# Altium schematic sheet MicroMod_ATP_CarrierBoard.SchDoc: MicroMod_ATP_CarrierBoard
size 456 x 318 mm; Origin: Eagle; Date: 4/11/2021 5:04:26 PM; SheetNumber: 1; DESIGNER: DESIGNER; REV: REV; GateName_1: G$1; SymbolName_1: FRAME_LEDGER; LibraryName: SparkFun-Aesthetics; DeviceSetName: FRAME-LEDGER; GateName_2: G$2; SymbolName_2: DOCFIELD; Sheet: Sheet:; ReleasedundertheCreativeCommons: Released under the Creative Commons; AttributionShare-Alike4.0License: Attribution Share-Alike 4.0 License; https://creativecommons.org/licenses/by-sa/4.0/: https://creativecommons.org/licenses/by-sa/4.0/; Designby: Design by:
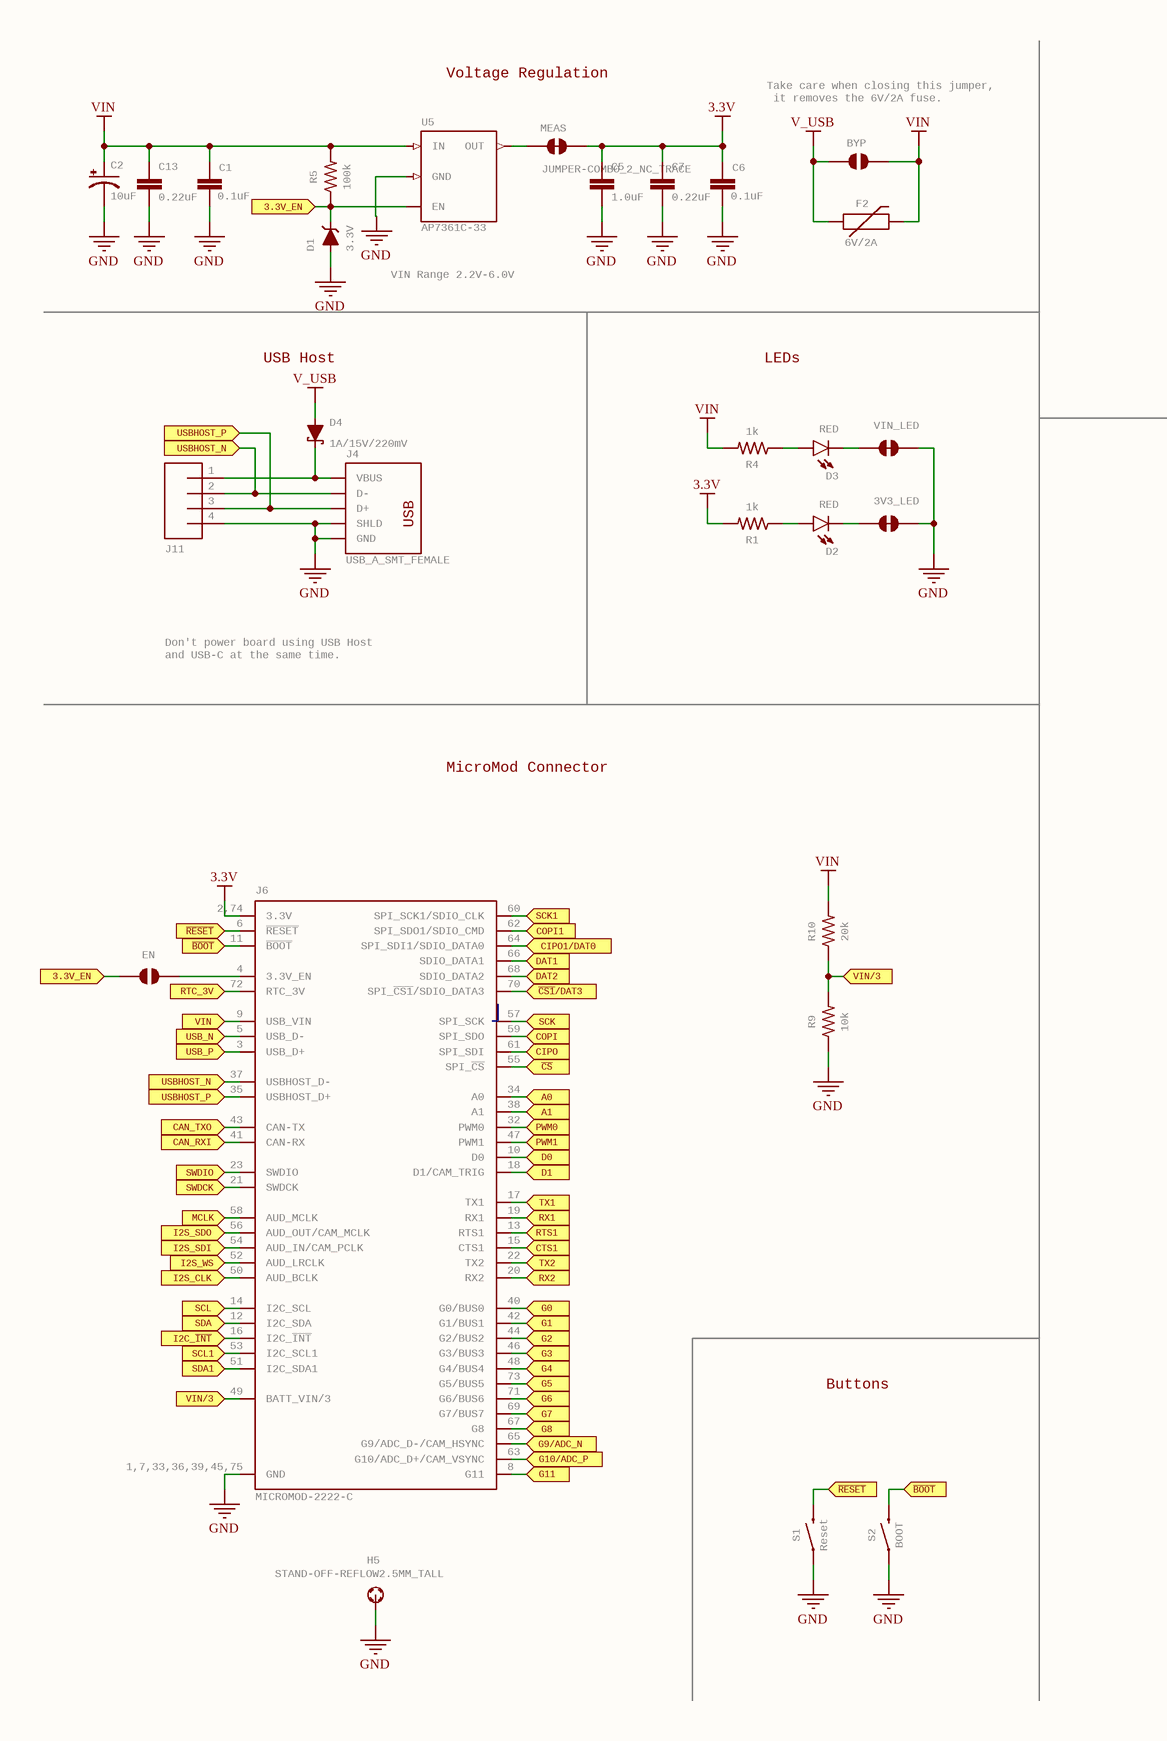
[diagram p0: MicroMod_ATP_CarrierBoard.SchDoc, left]
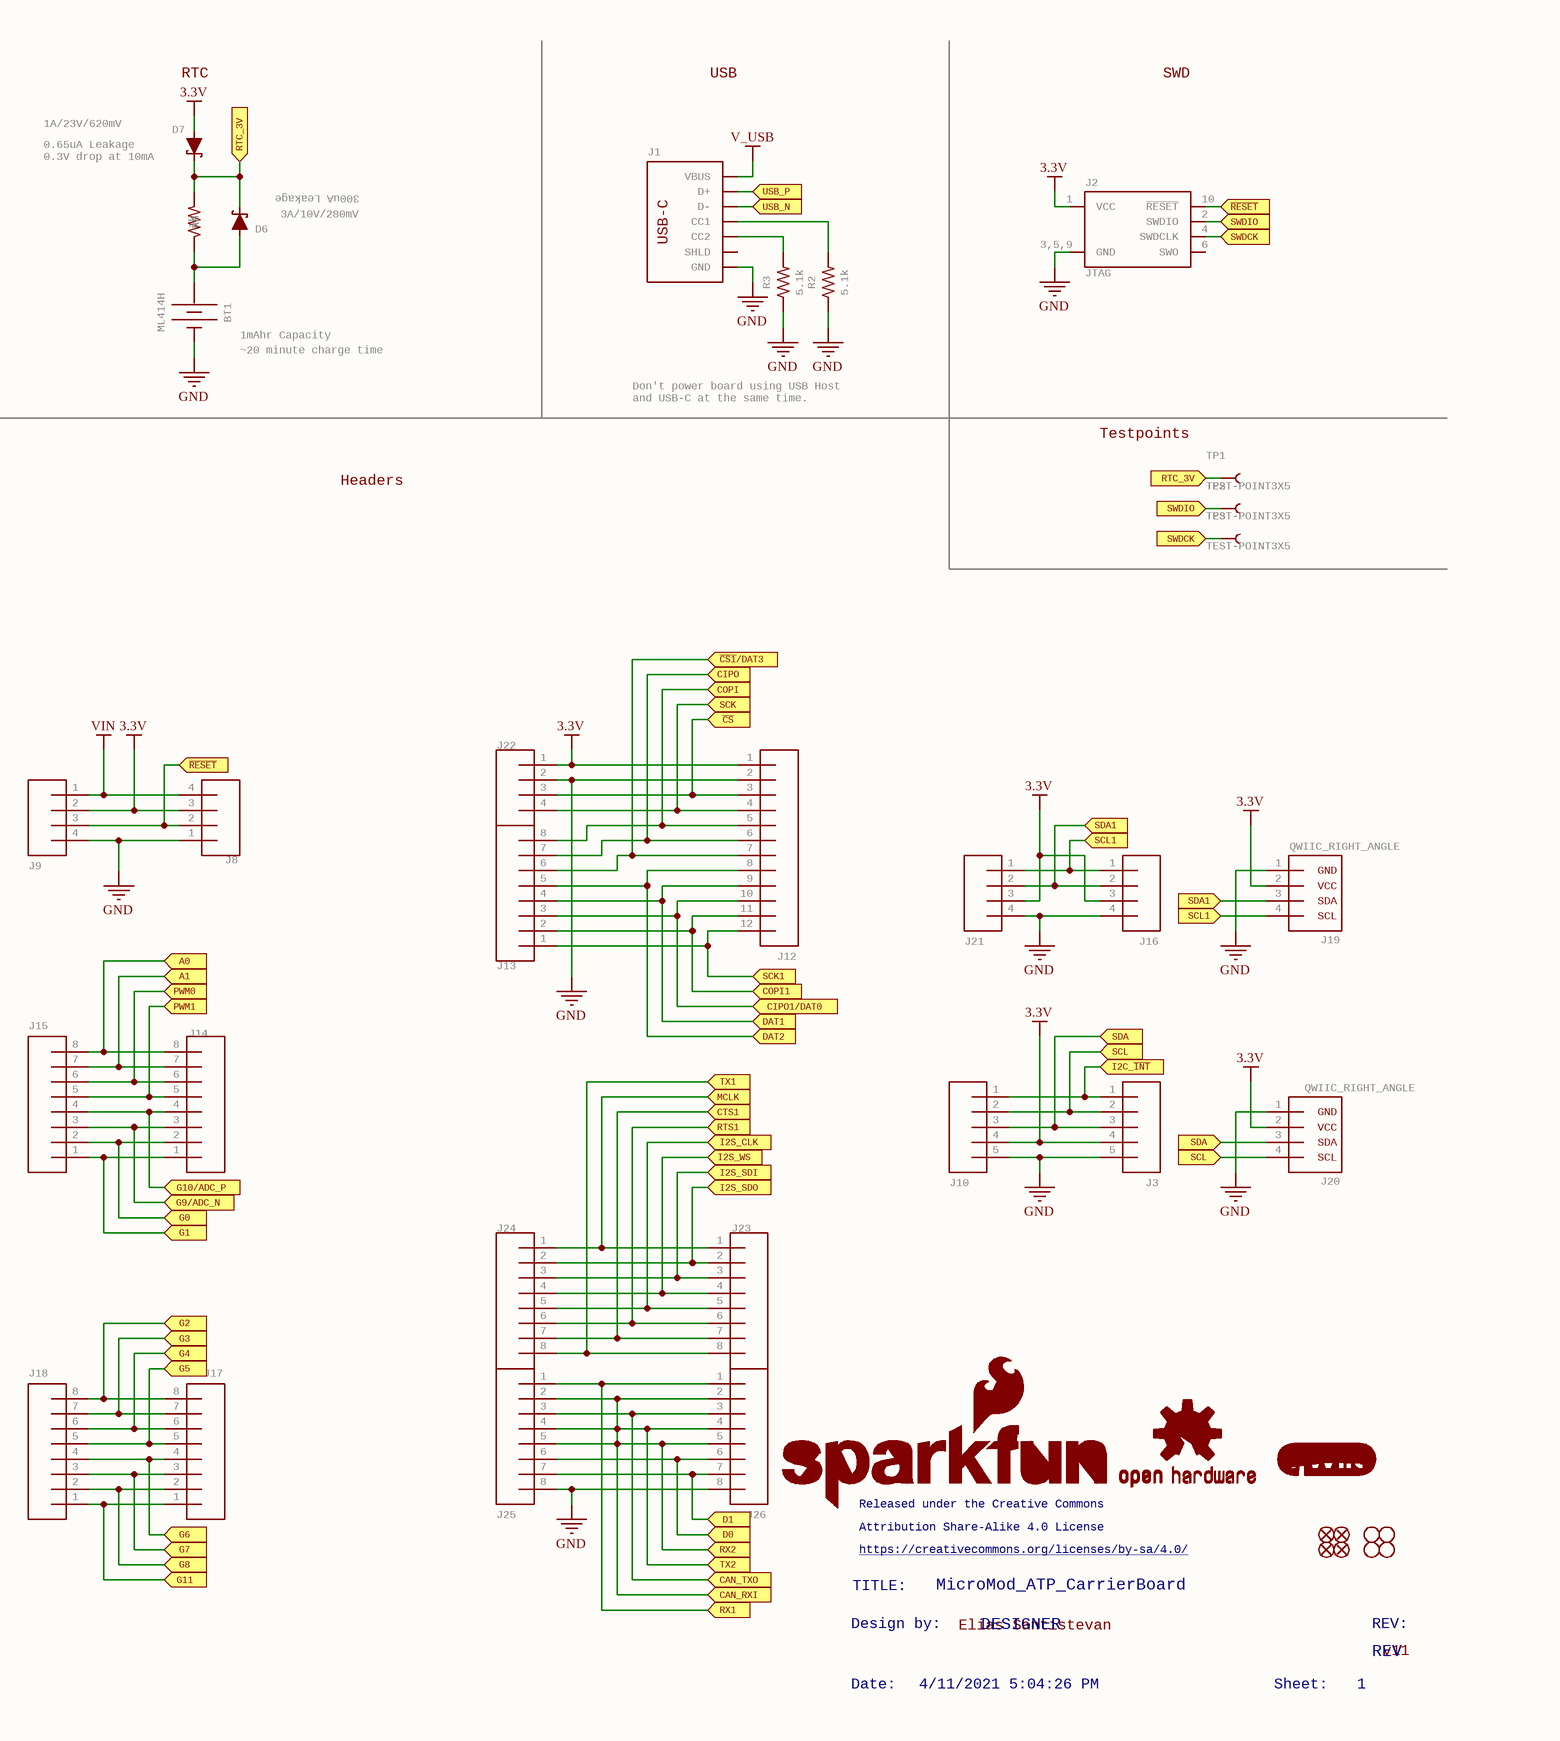
[diagram p1: MicroMod_ATP_CarrierBoard.SchDoc, right]

## Parts
3V3_LED  JUMPER-SMT_2_NC_TRACE_SILK  [SMT-JUMPER_2_NC_TRACE_SILK]  (value not drawn)
BT1  ML414H  [ML414H_IV01E]
BYP  JUMPER-SMT_2_NO_SILK  [SMT-JUMPER_2_NO_SILK]  (value not drawn)
C1  0.1uF  [0603]
C2  10uF  [EIA3216]
C5  1.0uF  [0603]
C6  0.1uF  [0603]
C7  0.22uF  [0603]
C13  0.22uF  [0603]
D1  3.3V  [SOD-323]
D2  RED  [LED-0603]
D3  RED  [LED-0603]
D4  1A/15V/220mV  [DO-214BA]
D6  3A/10V/280mV  [SOD-323]
D7  1A/23V/620mV  [SOD-323]
EN  JUMPER-SMT_2_NO_SILK  [SMT-JUMPER_2_NO_SILK]  (value not drawn)
F2  6V/2A  [1210]
FD1  FIDUCIALUFIDUCIAL  [FIDUCIAL-MICRO]  (value not drawn)
FD2  FIDUCIALUFIDUCIAL  [FIDUCIAL-MICRO]  (value not drawn)
FD3  FIDUCIALUFIDUCIAL  [FIDUCIAL-MICRO]  (value not drawn)
FD4  FIDUCIALUFIDUCIAL  [FIDUCIAL-MICRO]  (value not drawn)
H1  STAND-OFF  [STAND-OFF]  (value not drawn)
H2  STAND-OFF  [STAND-OFF]  (value not drawn)
H3  STAND-OFF  [STAND-OFF]  (value not drawn)
H4  STAND-OFF  [STAND-OFF]  (value not drawn)
H5  STAND-OFF-REFLOW2.5MM_TALL  [STAND-OFF-REFLOW-M2.5]
J1  USB_C_2-LAYER_PADS  [USB-C-16P-2LAYER-PADS]  (value not drawn)
J2  JTAG  [2X5-PTH-1.27MM]
J3  CONN_05NO_SILK  [1X05_NO_SILK]  (value not drawn)
J4  USB_A_SMT_FEMALE  [USB-A-S-SILK-FEMALE]
J6  MICROMOD-2222-C  [M.2-CONNECTOR-E]
J8  1X04_SMD_STRAIGHT_COMBO  [1X04_SMD_VERTICAL_COMBO]  (value not drawn)
J9  CONN_041X04_NO_SILK  [1X04_NO_SILK]  (value not drawn)
J10  CONN_05VERT_FEMALE_HEADER  [1X05_SMD_VERTICAL_COMBO]  (value not drawn)
J11  CONN_041X04_NO_SILK_NO_POP  [1X04_NO_SILK]  (value not drawn)
J12  CONN_12SMD_COMBINED  [1X12_SMD_COMBINED]  (value not drawn)
J13  CONN_08NO_SILK_DNP  [1X08_NO_SILK]  (value not drawn)
J14  CONN_08SMD-COMBO-FEMALE  [1X08_SMD_COMBINED]  (value not drawn)
J15  CONN_08NO_SILK_FEMALE_PTH  [1X08_NO_SILK]  (value not drawn)
J16  CONN_041X04_NO_SILK_NO_POP  [1X04_NO_SILK]  (value not drawn)
J17  CONN_08SMD-COMBO-FEMALE  [1X08_SMD_COMBINED]  (value not drawn)
J18  CONN_08NO_SILK_FEMALE_PTH  [1X08_NO_SILK]  (value not drawn)
J19  QWIIC_RIGHT_ANGLE  [JST04_1MM_RA]
J20  QWIIC_RIGHT_ANGLE  [JST04_1MM_RA]
J21  1X04_SMD_STRAIGHT_COMBO  [1X04_SMD_VERTICAL_COMBO]  (value not drawn)
J22  CONN_041X04_NO_SILK_NO_POP  [1X04_NO_SILK]  (value not drawn)
J23  CONN_08NO_SILK_FEMALE_PTH  [1X08_NO_SILK]  (value not drawn)
J24  CONN_08SMD-COMBO-FEMALE  [1X08_SMD_COMBINED]  (value not drawn)
J25  CONN_08SMD-COMBO-FEMALE  [1X08_SMD_COMBINED]  (value not drawn)
J26  CONN_08NO_SILK_FEMALE_PTH  [1X08_NO_SILK]  (value not drawn)
LOGO1  SFE_LOGO_NAME_FLAME.1_INCH  [SFE_LOGO_NAME_FLAME_.1]  (value not drawn)
LOGO2  QWIIC_LOGO_5MM  [QWIIC_5MM]  (value not drawn)
LOGO3  OSHW-LOGOMINI  [OSHW-LOGO-MINI]  (value not drawn)
MEAS  JUMPER-COMBO_2_NC_TRACE  [COMBO-JUMPER_2_NC_TRACE]
R1  1k  [0603]
R2  5.1k  [0603]
R3  5.1k  [0603]
R4  1k  [0603]
R5  100k  [0603]
R8  1k  [0603]
R9  10k  [0603]
R10  20k  [0603]
S1  Reset  [TACTILE_SWITCH_SMD_5.2MM]
S2  BOOT  [TACTILE_SWITCH_SMD_5.2MM]
TP1  TEST-POINT3X5  [PAD.03X.05]
TP2  TEST-POINT3X5  [PAD.03X.05]
TP3  TEST-POINT3X5  [PAD.03X.05]
U5  AP7361C-33  [UDFN-8]
VIN_LED  JUMPER-SMT_2_NC_TRACE_SILK  [SMT-JUMPER_2_NC_TRACE_SILK]  (value not drawn)

## Ports
3.3V_EN (in), A0 (in), A1 (in), CAN_RXI (in), CAN_TXO (in), CIPO1/DAT0 (in), CIPO (in), COPI1 (in), COPI (in), CTS1 (in), D0 (in), D1 (in), DAT1 (in), DAT2 (in), G0 (in), G1 (in), G2 (in), G3 (in), G4 (in), G5 (in), G6 (in), G7 (in), G8 (in), G9/ADC_N (in), G10/ADC_P (in), G11 (in), I2C_~{INT} (in), I2S_CLK (in), I2S_SDI (in), I2S_SDO (in), I2S_WS (in), MCLK (in), PWM0 (in), PWM1 (in), RTC_3V (in), RTS1 (in), RX1 (in), RX2 (in), SCK1 (in), SCK (in), SCL1 (in), SCL (in), SDA1 (in), SDA (in), SWDCK (in), SWDIO (in), TX1 (in), TX2 (in), USB_N (in), USB_P (in), USBHOST_N (in), USBHOST_P (in), VIN (in), VIN/3 (in), ~{BOOT} (in), ~{CS1}/DAT3 (in), ~{CS} (in), ~{RESET} (in)

## Nets
3.3V: C5.1 C6.1 C7.1 D7.A J2.1(VCC) J3.4 J6.2,74(3.3V) J8.3 J9.2 J10.4 J12.1 J16.3 J19.2 J20.2 J21.3 J22.1 MEAS.2,4 R1.2
GND: 3V3_LED.2 BT1.- C1.2 C2.- C5.2 C6.2 C7.2 C13.2 D1.A H5.1 J1.GND,GND2(GND) J2.3,5,9(GND) J3.5 J4.GND J4.SHLD1,2(SHLD) J6.1,7,33,36,39,45,75(GND) J8.1 J9.4 J10.5 J11.4 J12.2 J16.4 J19.1 J20.1 J21.4 J22.2 J25.8 J26.8 R2.1 R3.1 R9.1 S1.1,2 S2.1,2 U5.4,EP(GND) VIN_LED.2
V_USB: BYP.1 D4.A F2.1 J1.VBUS1,2(VBUS)
VIN: BYP.2 C1.1 C2.+ C13.1 F2.2 J8.4 J9.1 R4.2 R5.2 R10.2 U5.8(IN)
3.3V_EN: D1.C EN.1 R5.1 U5.5(EN) ; port 3.3V_EN
A0: J6.34(A0) J14.8 J15.8 ; port A0
A1: J6.38(A1) J14.7 J15.7 ; port A1
~{BOOT}: J6.11(~{BOOT}) S2.3,4 ; port ~{BOOT}
~{CS}: J6.55(SPI_~{CS}) J12.3 J22.3 ; port ~{CS}
~{CS1}/DAT3: J6.70(SPI_~{CS1}/SDIO_DATA3) J12.7 J13.6 ; port ~{CS1}/DAT3
CAN_RXI: J6.20(RX2) J6.22(TX2) J6.41(CAN-RX) J25.2 J25.4 J25.5 J26.2 J26.4 J26.5 ; port CAN_RXI, port TX2, port RX2
CAN_TXO: J6.43(CAN-TX) J25.3 J26.3 ; port CAN_TXO
CIPO: J6.61(SPI_SDI) J12.6 J13.7 ; port CIPO
CIPO1/DAT0: J6.64(SPI_SDI1/SDIO_DATA0) J12.10 J13.3 ; port CIPO1/DAT0
COPI: J6.59(SPI_SDO) J12.5 J13.8 ; port COPI
COPI1: J6.62(SPI_SDO1/SDIO_CMD) J12.11 J13.2 ; port COPI1
CTS1: J6.15(CTS1) J23.7 J24.7 ; port CTS1
D0: J6.10(D0) J25.6 J26.6 ; port D0
D1: J6.18(D1/CAM_TRIG) J25.7 J26.7 ; port D1
DAT1: J6.66(SDIO_DATA1) J12.9 J13.4 ; port DAT1
DAT2: J6.68(SDIO_DATA2) J12.8 J13.5 ; port DAT2
G0: J6.40(G0/BUS0) J14.2 J15.2 ; port G0
G1: J6.42(G1/BUS1) J14.1 J15.1 ; port G1
G2: J6.44(G2/BUS2) J17.8 J18.8 ; port G2
G3: J6.46(G3/BUS3) J17.7 J18.7 ; port G3
G4: J6.48(G4/BUS4) J17.6 J18.6 ; port G4
G5: J6.73(G5/BUS5) J17.5 J18.5 ; port G5
G6: J6.71(G6/BUS6) J17.4 J18.4 ; port G6
G7: J6.69(G7/BUS7) J17.3 J18.3 ; port G7
G8: J6.67(G8) J17.2 J18.2 ; port G8
G9/ADC_N: J6.65(G9/ADC_D-/CAM_HSYNC) J14.3 J15.3 ; port G9/ADC_N
G10/ADC_P: J6.63(G10/ADC_D+/CAM_VSYNC) J14.4 J15.4 ; port G10/ADC_P
G11: J6.8(G11) J17.1 J18.1 ; port G11
I2C_~{INT}: J3.1 J6.16(I2C_~{INT}) J10.1 ; port I2C_~{INT}
I2S_CLK: J6.50(AUD_BCLK) J23.5 J24.5 ; port I2S_CLK
I2S_SDI: J6.54(AUD_IN/CAM_PCLK) J23.3 J24.3 ; port I2S_SDI
I2S_SDO: J6.56(AUD_OUT/CAM_MCLK) J23.2 J24.2 ; port I2S_SDO
I2S_WS: J6.52(AUD_LRCLK) J23.4 J24.4 ; port I2S_WS
MCLK: J6.58(AUD_MCLK) J23.1 J24.1 ; port MCLK
PWM0: J6.32(PWM0) J14.6 J15.6 ; port PWM0
PWM1: J6.47(PWM1) J14.5 J15.5 ; port PWM1
~{RESET}: J2.10(~{RESET}) J6.6(~{RESET}) J8.2 J9.3 S1.3,4 ; port ~{RESET}
RTC_3V: D6.C D7.C J6.72(RTC_3V) R8.2 TP1.P$1 ; port RTC_3V
RTS1: J6.13(RTS1) J23.6 J24.6 ; port RTS1
RX1: J6.19(RX1) J25.1 J26.1 ; port RX1
SCK: J6.57(SPI_SCK) J12.4 J22.4 ; port SCK
SCK1: J6.60(SPI_SCK1/SDIO_CLK) J12.12 J13.1 ; port SCK1
SCL: J3.2 J6.14(I2C_SCL) J10.2 J20.4 ; port SCL
SCL1: J6.53(I2C_SCL1) J16.1 J19.4 J21.1 ; port SCL1
SDA: J3.3 J6.12(I2C_SDA) J10.3 J20.3 ; port SDA
SDA1: J6.51(I2C_SDA1) J16.2 J19.3 J21.2 ; port SDA1
SWDCK: J2.4(SWDCLK) J6.21(SWDCK) TP3.P$1 ; port SWDCK
SWDIO: J2.2(SWDIO) J6.23(SWDIO) TP2.P$1 ; port SWDIO
TX1: J6.17(TX1) J23.8 J24.8 ; port TX1
USB_N: J1.A7,B7(D-) J6.5(USB_D-) ; port USB_N
USB_P: J1.A6,B6(D+) J6.3(USB_D+) ; port USB_P
USBHOST_N: J4.D- J6.37(USBHOST_D-) J11.2 ; port USBHOST_N
USBHOST_P: J4.D+ J6.35(USBHOST_D+) J11.3 ; port USBHOST_P
VIN: J6.9(USB_VIN) ; port VIN  [a separate net that carries the same name]
VIN/3: J6.49(BATT_VIN/3) R9.2 R10.1 ; port VIN/3
Net3V3_LED_1: 3V3_LED.1 D2.C
NetBT1_+: BT1.+ D6.A R8.1
NetD2_A: D2.A R1.1
NetD3_A: D3.A R4.1
NetD3_C: D3.C VIN_LED.1
NetD4_C: D4.C J4.VBUS J11.1
NetEN_2: EN.2 J6.4(3.3V_EN)
NetJ1_A5: J1.A5(CC1) R2.2
NetJ1_B5: J1.B5(CC2) R3.2
NetMEAS_1,3: MEAS.1,3 U5.1(OUT)

Not connected (* = marked no-connect by the designer): J1 SHLD1-4(SHLD); J2 6(SWO)

## Notes on the sheet
- Voltage Regulation
- (near D7) RTC
- USB
- SWD
- Take care when closing this jumper,
  it removes the 6V/2A fuse.
- (near D7) 0.65uA Leakage
  0.3V drop at 10mA
- (near D6) 300uA Leakage
- VIN Range 2.2V-6.0V
- (near D4) USB Host
- LEDs
- (near BT1) ~20 minute charge time
- (near BT1) 1mAhr Capacity
- Don't power board using USB Host
  and USB-C at the same time.
- Testpoints
- Headers
- MicroMod Connector
- Buttons
- Released under the Creative Commons
- TITLE:
- Attribution Share-Alike 4.0 License
- https://creativecommons.org/licenses/by-sa/4.0/
- MicroMod_ATP_CarrierBoard
- Design by:
- Elias Santistevan
- DESIGNER
- REV:
- REV
- v11
- Date:
- 4/11/2021 5:04:26 PM
- Sheet:
- 1

## Library data of the parts
3V3_LED VIN_LED = JUMPER-SMT_2_NC_TRACE_SILK: Normally closed trace jumper    This jumper has a trace between two pads so it's normally closed (NC). Use a razor knife to open the connection. For best results follow the IPC guidelines for cutting traces: Cutout at least 0.063 mm (0.005 in).  Remove all loose material to clean up the cut area.  Seal the cut with an approved epoxy.       Reapply solder to reclose the connection.; GateName_1: G$1; SymbolName_1: SMT-JUMPER_2_NC_TRACE; DeviceName: _SILK; LibraryName: SparkFun-Jumpers; DeviceSetName: JUMPER-SMT_2_NC_TRACE
BT1 = ML414H_IV01E_BATTERY: SEIKO ML414H-IV01E Reflowable Lithium Battery    ML414H is a rechargeable, coin type battery with features such as Pb-free reflowable (Peak temperature: 260 C) and high temperature heat resistance. Battery Characteristics:  3.1V max voltage  Voff is 2V  1mAH  3k series resistor with battery  72 hour charge time from 2.0-3.1V  2.3-2.8V initial charge; GateName_1: G$1; PROD_ID: BATT-14267; SymbolName_1: BATTERY; LibraryName: SparkFun-Batteries; DeviceSetName: ML414H_IV01E_BATTERY
BYP EN = JUMPER-SMT_2_NO_SILK: Normally open jumper    This jumper has two pads in close proximity to each other. Apply solder to close the connection.   Round pads are easier to solder for beginners, but are a lot larger.   SparkFun Product that uses the round pads:  SparkFun EL Sequencer; GateName_1: G$1; SymbolName_1: SMT-JUMPER_2_NO; DeviceName: _SILK; LibraryName: SparkFun-Jumpers; DeviceSetName: JUMPER-SMT_2_NO
C1 C6 = 0.1UF-0603-25V-(+80/-20%): 0.1ÂµF ceramic capacitors    A capacitor is a passive two-terminal electrical component used to store electrical energy temporarily in an electric field.; GateName_1: G$1; SymbolName_1: CAP; PROD_ID: CAP-00810; DeviceName: -0603-25V-(+80/-20%); LibraryName: SparkFun-Capacitors; DeviceSetName: 0.1UF
C2 = 10UF-POLAR-EIA3216-16V-10%(TANT): 10.0ÂµF polarized capacitors    A capacitor is a passive two-terminal electrical component used to store electrical energy temporarily in an electric field.; GateName_1: G$1; SymbolName_1: CAP_POL; PROD_ID: CAP-00811; DeviceName: -EIA3216-16V-10%(TANT); LibraryName: SparkFun-Capacitors; DeviceSetName: 10UF-POLAR
C5 = 1.0UF-0603-16V-10%: 1ÂµF ceramic capacitors    A capacitor is a passive two-terminal electrical component used to store electrical energy temporarily in an electric field.; GateName_1: G$1; SymbolName_1: CAP; PROD_ID: CAP-00868; DeviceName: -0603-16V-10%; LibraryName: SparkFun-Capacitors; DeviceSetName: 1.0UF
C7 C13 = 0.22UF-0603-25V-10%: 0.22ÂµF ceramic capacitors    A capacitor is a passive two-terminal electrical component used to store electrical energy temporarily in an electric field.; GateName_1: G$1; SymbolName_1: CAP; PROD_ID: CAP-07822; DeviceName: -0603-25V-10%; LibraryName: SparkFun-Capacitors; DeviceSetName: 0.22UF
D1 = DIODE-ZENER-MM3Z3V3T1G: Zener Diode    A Zener diode allows current to flow from its anode to its cathode like a normal semiconductor diode, but it also permits current to flow in the reverse direction when its "Zener voltage" is reached. - WIkipedia; GateName_1: G$1; PROD_ID: DIO-11284; SymbolName_1: DIODE-ZENER; DeviceName: -MM3Z3V3T1G; LibraryName: SparkFun-DiscreteSemi; DeviceSetName: DIODE-ZENER
D2 D3 = LED-RED0603: Red SMD LED    Used in manufacturing of most products at SparkFun   Packages: 0603 - SMD 0603 package [Product Link]  0603 SMART - SMD 0603 SMART package ( more efficient and expensive)[Product Link]   1206 - SMD1206  package [Product Link]    SparkFun Products: Pro Mini 328 -5V  RedBoard  IOIO-OTG; GateName_1: G$1; DeviceName: 0603; PROD_ID: DIO-00819; SymbolName_1: LED; LibraryName: SparkFun-LED; DeviceSetName: LED-RED
D4 = DIODE-SCHOTTKY-LSM115JE3: Schottky diode    A Schottky diode is a semiconductor diode which has a low forward voltage drop and a very fast switching action.; GateName_1: G$1; PROD_ID: DIO-15271; SymbolName_1: DIODE-SCHOTTKY; DeviceName: -LSM115JE3; LibraryName: SparkFun-DiscreteSemi; DeviceSetName: DIODE-SCHOTTKY
D6 = DIODE-SCHOTTKY-BAT60A: Schottky diode    A Schottky diode is a semiconductor diode which has a low forward voltage drop and a very fast switching action.; GateName_1: G$1; PROD_ID: DIO-14072; SymbolName_1: DIODE-SCHOTTKY; DeviceName: -BAT60A; LibraryName: SparkFun-DiscreteSemi; DeviceSetName: DIODE-SCHOTTKY
D7 = DIODE-SCHOTTKY-BAT20J: Schottky diode    A Schottky diode is a semiconductor diode which has a low forward voltage drop and a very fast switching action.; GateName_1: G$1; PROD_ID: DIO-11623; SymbolName_1: DIODE-SCHOTTKY; DeviceName: -BAT20J; LibraryName: SparkFun-DiscreteSemi; DeviceSetName: DIODE-SCHOTTKY
F2 = PPTC_6V2A: Resettable Fuse PPTC    Resettable Fuse. Really a sort of resistor with a polymeric positive temperature coefficient whose resistance increases dramatically with an increase in temperature. When heated by the power passing through the resistance rises causing the current to be limited, protecting the circuit. This is achieved by the transition of the polymer from a crystalline to an amorphous state where the conductive carbon separates breaking the conductive pathways found in the cool crystalline structure. When a PPTC cools back down it resumes conducting letting the circuit turn back on.   SparkFun Products:  SparkFun RedBoard - Programmed with Arduino  Pro Micro - 5V/16MHz  Arduino Pro 328 - 5V/16MHz  MP3 Trigger; GateName_1: F1; DeviceName: _6V2A; PROD_ID: RES-14313; SymbolName_1: PPTC; LibraryName: SparkFun-Fuses; DeviceSetName: PPTC
FD1-FD4 = FIDUCIALUFIDUCIAL: Fiducial Alignment Points    Point-of-reference for pick-and-place machines and other optical instruments.; GateName_1: G$1; SymbolName_1: FIDUCIAL; DeviceName: UFIDUCIAL; LibraryName: SparkFun-Aesthetics; DeviceSetName: FIDUCIAL
H1-H4 = STAND-OFF: Stand Off    Drill holes for mechanically mounting via screws, standoffs, etc.   Note: Use the keepout ring to avoid running the screw head into surrounding components.  Variant Overviews  STAND-OFF - Mechanical footprint for a #4 phillips button head screw.  STAND-OFF-TIGHT - Mechanical footprint for a #4 phillips button head screw,      Example SparkFun Products  Screw - Phillips Head (1/4", 4-40, 10 pack) (PRT-10453)  Screw - Phillips Head (1/2", 4-40, 10 pack) (PRT-10452)  Screw - Phillips Head (3/4", 4-40, 10 pack) (PRT-10451)  Screw - Phillips Head (1", 4-40, 10 pack) (PRT-10450); GateName_1: G$1; SymbolName_1: STAND-OFF; LibraryName: SparkFun-Hardware; DeviceSetName: STAND-OFF
H5 = STAND-OFF-REFLOW2.5MM_TALL: Stand Off Reflow Compatible    A metal standoff that can be placed and reflowed onto a PCB.; GateName_1: G$1; PROD_ID: HW-14899; SymbolName_1: STAND-OFF-REFLOW; DeviceName: 2.5MM_TALL; LibraryName: SparkFun-Hardware; DeviceSetName: STAND-OFF-REFLOW
J1 = USB_C_2-LAYER_PADS: USB Type C 16Pin Connector Super Speed pins not available on the 16-pin purely SMD connector so this part is best for USB 2.0 implementations. D1 and D2 are tied together enabling D+/- no matter which way the cable is plugged into the connector. The two channel configuration pins (CC1/2) are exposed. These are normally connected to ground via 5.1k resistors but can be reconfigured for high current/high power applications.; GateName_1: J1; SymbolName_1: USB-C-MINIMUM; DeviceSetName: USB_C; PROD_ID: CONN-14122; DeviceName: _2-LAYER_PADS; LibraryName: SparkFun-Connectors; USB-C: USB-C
J2 = CORTEX_JTAG_DEBUG_MINIMUM_PTH: Cortex Debug Connector - 10 pin    Supports JTAG debug, Serial Wire debug, and Serial Wire Viewer. PTH and SMD connector options available.    General Connector Information    Products: PTH Connector -via Digi-Key  SparkFun PSoc  SparkFun T; GateName_1: G$1; SymbolName_1: CORTEX_DEBUG_MINIMUM; DeviceName: _PTH; LibraryName: SparkFun-Connectors; DeviceSetName: CORTEX_JTAG_DEBUG_MINIMUM
J3 = CONN_05NO_SILK: Multi connection point. Often used as Generic Header-pin footprint for 0.1 inch spaced/style header connections    On any of the 0.1 inch spaced packages, you can populate with these:  Break Away Headers - Straight (PRT-00116)   Break Away Male Headers - Right Angle (PRT-00553)   Female Headers (PRT-00115)   Break Away Headers - Machine Pin (PRT-00117)   Break Away Female Headers - Swiss Machine Pin (PRT-00743)        For SCREWTERMINALS and SPRING TERMINALS visit here:  Screw Terimnals on SparkFun.com (5mm/3.5mm/2.54mm spacing)       This device is also useful as a general connection point to wire up your design to another part of your project. Our various solder wires solder well into these plated through hole pads.  Hook-Up Wire - Assortment (Stranded, 22 AWG) (PRT-11375)   Hook-Up Wire - Assortment (Solid Core, 22 AWG) (PRT-11367)   View the entire wire category on our website here          Special notes:     Molex polarized connector foot print use with SKU : PRT-08231 with associated crimp pins and housings. 1MM SMD Version SKU: PRT-10208; GateName_1: G$1; SymbolName_1: CONN_05; DeviceName: NO_SILK; LibraryName: SparkFun-Connectors; DeviceSetName: CONN_05
J4 = USB_A_SMT_FEMALE: USB-A Connector    Male and female variants, as well as PTH and SMT variants   SparkFun Products:  SparkFun XBee Explorer Dongle PTH Male  SparkFun MicroView-USB Programmer SMT Male  SparkFun USB Type A Female Breakout SMT Female; GateName_1: G$1; DeviceSetName: USB_A; PROD_ID: CONN-09520; SF_ID: PRT-09011; SymbolName_1: USB; DeviceName: _SMT_FEMALE; LibraryName: SparkFun-Connectors; USB: USB
J6 = MICROMOD-2222-C: MicroMod Connector  Description: A card edge connector and mating PCB connector to allow various MicroMod Processor Boards to be coupled with various carrier boards of different capabilities. Based on the M.2 standard.; GateName_1: J1; PROD_ID: CONN-14877; SymbolName_1: MICROMOD; DeviceName: -2222-C; LibraryName: SparkFun-MicroMod; DeviceSetName: MICROMOD
J8 J21 = CONN_04SMD_STRAIGHT_COMBO: Multi connection point. Often used as Generic Header-pin footprint for 0.1 inch spaced/style header connections    On any of the 0.1 inch spaced packages, you can populate with these:  Break Away Headers - Straight (PRT-00116)   Break Away Male Headers - Right Angle (PRT-00553)   Female Headers (PRT-00115)   Break Away Headers - Machine Pin (PRT-00117)   Break Away Female Headers - Swiss Machine Pin (PRT-00743)        For SCREWTERMINALS and SPRING TERMINALS visit here:  Screw Terimnals on SparkFun.com (5mm/3.5mm/2.54mm spacing)       This device is also useful as a general connection point to wire up your design to another part of your project. Our various solder wires solder well into these plated through hole pads.  Hook-Up Wire - Assortment (Stranded, 22 AWG) (PRT-11375)   Hook-Up Wire - Assortment (Solid Core, 22 AWG) (PRT-11367)   View the entire wire category on our website here          Special notes:     Molex polarized connector foot print use with SKU : PRT-08231 with associated crimp pins and housings. 1MM SMD Version SKU: PRT-10208; GateName_1: J1; PROD_ID: CONN-08511; SymbolName_1: CONN_04; DeviceName: SMD_STRAIGHT_COMBO; LibraryName: SparkFun-Connectors; DeviceSetName: CONN_04
J9 = CONN_041X04_NO_SILK: Multi connection point. Often used as Generic Header-pin footprint for 0.1 inch spaced/style header connections    On any of the 0.1 inch spaced packages, you can populate with these:  Break Away Headers - Straight (PRT-00116)   Break Away Male Headers - Right Angle (PRT-00553)   Female Headers (PRT-00115)   Break Away Headers - Machine Pin (PRT-00117)   Break Away Female Headers - Swiss Machine Pin (PRT-00743)        For SCREWTERMINALS and SPRING TERMINALS visit here:  Screw Terimnals on SparkFun.com (5mm/3.5mm/2.54mm spacing)       This device is also useful as a general connection point to wire up your design to another part of your project. Our various solder wires solder well into these plated through hole pads.  Hook-Up Wire - Assortment (Stranded, 22 AWG) (PRT-11375)   Hook-Up Wire - Assortment (Solid Core, 22 AWG) (PRT-11367)   View the entire wire category on our website here          Special notes:     Molex polarized connector foot print use with SKU : PRT-08231 with associated crimp pins and housings. 1MM SMD Version SKU: PRT-10208; GateName_1: J1; PROD_ID: CONN-09696; SymbolName_1: CONN_04; DeviceName: 1X04_NO_SILK; LibraryName: SparkFun-Connectors; DeviceSetName: CONN_04
J10 = CONN_05VERT_FEMALE_HEADER: Multi connection point. Often used as Generic Header-pin footprint for 0.1 inch spaced/style header connections    On any of the 0.1 inch spaced packages, you can populate with these:  Break Away Headers - Straight (PRT-00116)   Break Away Male Headers - Right Angle (PRT-00553)   Female Headers (PRT-00115)   Break Away Headers - Machine Pin (PRT-00117)   Break Away Female Headers - Swiss Machine Pin (PRT-00743)        For SCREWTERMINALS and SPRING TERMINALS visit here:  Screw Terimnals on SparkFun.com (5mm/3.5mm/2.54mm spacing)       This device is also useful as a general connection point to wire up your design to another part of your project. Our various solder wires solder well into these plated through hole pads.  Hook-Up Wire - Assortment (Stranded, 22 AWG) (PRT-11375)   Hook-Up Wire - Assortment (Solid Core, 22 AWG) (PRT-11367)   View the entire wire category on our website here          Special notes:     Molex polarized connector foot print use with SKU : PRT-08231 with associated crimp pins and housings. 1MM SMD Version SKU: PRT-10208; GateName_1: G$1; PROD_ID: CONN-15262; SymbolName_1: CONN_05; DeviceName: VERT_FEMALE_HEADER; LibraryName: SparkFun-Connectors; DeviceSetName: CONN_05
J11 J16 J22 = CONN_041X04_NO_SILK_NO_POP: Multi connection point. Often used as Generic Header-pin footprint for 0.1 inch spaced/style header connections    On any of the 0.1 inch spaced packages, you can populate with these:  Break Away Headers - Straight (PRT-00116)   Break Away Male Headers - Right Angle (PRT-00553)   Female Headers (PRT-00115)   Break Away Headers - Machine Pin (PRT-00117)   Break Away Female Headers - Swiss Machine Pin (PRT-00743)        For SCREWTERMINALS and SPRING TERMINALS visit here:  Screw Terimnals on SparkFun.com (5mm/3.5mm/2.54mm spacing)       This device is also useful as a general connection point to wire up your design to another part of your project. Our various solder wires solder well into these plated through hole pads.  Hook-Up Wire - Assortment (Stranded, 22 AWG) (PRT-11375)   Hook-Up Wire - Assortment (Solid Core, 22 AWG) (PRT-11367)   View the entire wire category on our website here          Special notes:     Molex polarized connector foot print use with SKU : PRT-08231 with associated crimp pins and housings. 1MM SMD Version SKU: PRT-10208; GateName_1: J1; SymbolName_1: CONN_04; DeviceName: 1X04_NO_SILK_NO_POP; LibraryName: SparkFun-Connectors; DeviceSetName: CONN_04
J12 = CONN_12SMD_COMBINED: Multi connection point. Often used as Generic Header-pin footprint for 0.1 inch spaced/style header connections    On any of the 0.1 inch spaced packages, you can populate with these:  Break Away Headers - Straight (PRT-00116)   Break Away Male Headers - Right Angle (PRT-00553)   Female Headers (PRT-00115)   Break Away Headers - Machine Pin (PRT-00117)   Break Away Female Headers - Swiss Machine Pin (PRT-00743)        For SCREWTERMINALS and SPRING TERMINALS visit here:  Screw Terimnals on SparkFun.com (5mm/3.5mm/2.54mm spacing)       This device is also useful as a general connection point to wire up your design to another part of your project. Our various solder wires solder well into these plated through hole pads.  Hook-Up Wire - Assortment (Stranded, 22 AWG) (PRT-11375)   Hook-Up Wire - Assortment (Solid Core, 22 AWG) (PRT-11367)   View the entire wire category on our website here          Special notes:     Molex polarized connector foot print use with SKU : PRT-08231 with associated crimp pins and housings. 1MM SMD Version SKU: PRT-10208    NOTES ON THE VARIANTS LOCK and LOCK_LONGPADS... This footprint was designed to help hold the alignment of a through-hole component (i.e.  6-pin header) while soldering it into place. You may notice that each hole has been shifted either up or down by 0.005 of an inch from it's more standard position (which is a perfectly straight line).  This slight alteration caused the pins (the squares in the middle) to touch the edges of the holes.  Because they are alternating, it causes a "brace" to hold the component in place.  0.005 has proven to be the perfect amount of "off-center" position when using our standard breakaway headers. Although looks a little odd when you look at the bare footprint, once you have a header in there, the alteration is very hard to notice.  Also,if you push a header all the way into place, it is covered up entirely on the bottom side.; GateName_1: G$1; PROD_ID: CONN-15197; SymbolName_1: CONN_12; DeviceName: SMD_COMBINED; LibraryName: SparkFun-Connectors; DeviceSetName: CONN_12
J13 = CONN_08NO_SILK_DNP: Multi connection point. Often used as Generic Header-pin footprint for 0.1 inch spaced/style header connections    On any of the 0.1 inch spaced packages, you can populate with these:  Break Away Headers - Straight (PRT-00116)   Break Away Male Headers - Right Angle (PRT-00553)   Female Headers (PRT-00115)   Break Away Headers - Machine Pin (PRT-00117)   Break Away Female Headers - Swiss Machine Pin (PRT-00743)   Arduino Stackable Header - 8 Pin (PRT-09279)        For SCREWTERMINALS and SPRING TERMINALS visit here:  Screw Terimnals on SparkFun.com (5mm/3.5mm/2.54mm spacing)       This device is also useful as a general connection point to wire up your design to another part of your project. Our various solder wires solder well into these plated through hole pads.  Hook-Up Wire - Assortment (Stranded, 22 AWG) (PRT-11375)   Hook-Up Wire - Assortment (Solid Core, 22 AWG) (PRT-11367)   View the entire wire category on our website here          Special notes:     Molex polarized connector foot print use with SKU : PRT-08231 with associated crimp pins and housings. 1MM SMD Version SKU: PRT-10208    NOTES ON THE VARIANTS LOCK and LOCK_LONGPADS... This footprint was designed to help hold the alignment of a through-hole component (i.e.  6-pin header) while soldering it into place. You may notice that each hole has been shifted either up or down by 0.005 of an inch from it's more standard position (which is a perfectly straight line).  This slight alteration caused the pins (the squares in the middle) to touch the edges of the holes.  Because they are alternating, it causes a "brace" to hold the component in place.  0.005 has proven to be the perfect amount of "off-center" position when using our standard breakaway headers. Although looks a little odd when you look at the bare footprint, once you have a header in there, the alteration is very hard to notice.  Also,if you push a header all the way into place, it is covered up entirely on the bottom side.; GateName_1: G$1; SymbolName_1: CONN_08; DeviceName: NO_SILK_DNP; LibraryName: SparkFun-Connectors; DeviceSetName: CONN_08
J14 J17 J24 J25 = CONN_08SMD-COMBO-FEMALE: Multi connection point. Often used as Generic Header-pin footprint for 0.1 inch spaced/style header connections    On any of the 0.1 inch spaced packages, you can populate with these:  Break Away Headers - Straight (PRT-00116)   Break Away Male Headers - Right Angle (PRT-00553)   Female Headers (PRT-00115)   Break Away Headers - Machine Pin (PRT-00117)   Break Away Female Headers - Swiss Machine Pin (PRT-00743)   Arduino Stackable Header - 8 Pin (PRT-09279)        For SCREWTERMINALS and SPRING TERMINALS visit here:  Screw Terimnals on SparkFun.com (5mm/3.5mm/2.54mm spacing)       This device is also useful as a general connection point to wire up your design to another part of your project. Our various solder wires solder well into these plated through hole pads.  Hook-Up Wire - Assortment (Stranded, 22 AWG) (PRT-11375)   Hook-Up Wire - Assortment (Solid Core, 22 AWG) (PRT-11367)   View the entire wire category on our website here          Special notes:     Molex polarized connector foot print use with SKU : PRT-08231 with associated crimp pins and housings. 1MM SMD Version SKU: PRT-10208    NOTES ON THE VARIANTS LOCK and LOCK_LONGPADS... This footprint was designed to help hold the alignment of a through-hole component (i.e.  6-pin header) while soldering it into place. You may notice that each hole has been shifted either up or down by 0.005 of an inch from it's more standard position (which is a perfectly straight line).  This slight alteration caused the pins (the squares in the middle) to touch the edges of the holes.  Because they are alternating, it causes a "brace" to hold the component in place.  0.005 has proven to be the perfect amount of "off-center" position when using our standard breakaway headers. Although looks a little odd when you look at the bare footprint, once you have a header in there, the alteration is very hard to notice.  Also,if you push a header all the way into place, it is covered up entirely on the bottom side.; GateName_1: G$1; PROD_ID: CONN-10204; SF_ID: PRT-11543; SymbolName_1: CONN_08; DeviceName: SMD-COMBO-FEMALE; LibraryName: SparkFun-Connectors; DeviceSetName: CONN_08
J15 J18 J23 J26 = CONN_08NO_SILK_FEMALE_PTH: Multi connection point. Often used as Generic Header-pin footprint for 0.1 inch spaced/style header connections    On any of the 0.1 inch spaced packages, you can populate with these:  Break Away Headers - Straight (PRT-00116)   Break Away Male Headers - Right Angle (PRT-00553)   Female Headers (PRT-00115)   Break Away Headers - Machine Pin (PRT-00117)   Break Away Female Headers - Swiss Machine Pin (PRT-00743)   Arduino Stackable Header - 8 Pin (PRT-09279)        For SCREWTERMINALS and SPRING TERMINALS visit here:  Screw Terimnals on SparkFun.com (5mm/3.5mm/2.54mm spacing)       This device is also useful as a general connection point to wire up your design to another part of your project. Our various solder wires solder well into these plated through hole pads.  Hook-Up Wire - Assortment (Stranded, 22 AWG) (PRT-11375)   Hook-Up Wire - Assortment (Solid Core, 22 AWG) (PRT-11367)   View the entire wire category on our website here          Special notes:     Molex polarized connector foot print use with SKU : PRT-08231 with associated crimp pins and housings. 1MM SMD Version SKU: PRT-10208    NOTES ON THE VARIANTS LOCK and LOCK_LONGPADS... This footprint was designed to help hold the alignment of a through-hole component (i.e.  6-pin header) while soldering it into place. You may notice that each hole has been shifted either up or down by 0.005 of an inch from it's more standard position (which is a perfectly straight line).  This slight alteration caused the pins (the squares in the middle) to touch the edges of the holes.  Because they are alternating, it causes a "brace" to hold the component in place.  0.005 has proven to be the perfect amount of "off-center" position when using our standard breakaway headers. Although looks a little odd when you look at the bare footprint, once you have a header in there, the alteration is very hard to notice.  Also,if you push a header all the way into place, it is covered up entirely on the bottom side.; GateName_1: G$1; PROD_ID: CONN-08438; SymbolName_1: CONN_08; DeviceName: NO_SILK_FEMALE_PTH; LibraryName: SparkFun-Connectors; DeviceSetName: CONN_08
J19 J20 = QWIIC_CONNECTORJS-1MM: SparkFun I2C Standard Qwiic Connector An SMD 1mm pitch JST connector makes it easy and quick (get it? Qwiic?) to connect I2C devices to each other. The Qwiic system enables fast and solderless connection between popular platforms and various sensors and actuators.   We carry 200mm, 100mm, 50mm, and breadboard friendly Qwiic cables. We also offer 10 pcs strips the SMD connectors.; GateName_1: G$1; SymbolName_1: I2C_STANDARD; DeviceName: JS-1MM; PROD_ID: CONN-13694; LibraryName: SparkFun-Connectors; DeviceSetName: QWIIC_CONNECTOR; SDA: SDA; VCC: VCC; GND: GND; SCL: SCL
LOGO1 = SFE_LOGO_NAME_FLAME.1_INCH: SparkFun Font Logo w/ Flame    This is the SparkFun full logo. The logo on the schematic will always be the same size; the package variant is the height of the flame part of the logo. Default layer for the logo on the board is tSilk.; GateName_1: G$1; SymbolName_1: SFE_LOGO_NAME_FLAME; DeviceName: .1_INCH; LibraryName: SparkFun-Aesthetics; DeviceSetName: SFE_LOGO_NAME_FLAME
LOGO2 = QWIIC_LOGO_5MM: Qwiic Logos for placement on schematic and PCB. The 5.5mm silk logo is best for placing next to Qwiic connector.; GateName_1: G$1; DeviceName: _5MM; SymbolName_1: LOGO; LibraryName: SparkFun-Aesthetics; DeviceSetName: QWIIC_LOGO
LOGO3 = OSHW-LOGOMINI: Open-Source Hardware (OSHW) Logo     This logo indicates the piece of hardware it is found on incorporates a OSHW license and/or adheres to the definition of open source hardware found here: http://freedomdefined.org/OSHW; GateName_1: G$1; DeviceName: MINI; SymbolName_1: OSHW-LOGO; LibraryName: SparkFun-Aesthetics; DeviceSetName: OSHW-LOGO
MEAS = JUMPER-COMBO_2_NC_TRACE: GateName_1: JP1; SymbolName_1: SMT-JUMPER_2_NC_TRACE-1; LibraryName: SparkFun-Jumpers; DeviceSetName: JUMPER-COMBO_2_NC_TRACE
R1 R4 R8 = 1KOHM-0603-1/10W-1%: 1kÎ© resistor    A resistor is a passive two-terminal electrical component that implements electrical resistance as a circuit element. Resistors act to reduce current flow, and, at the same time, act to lower voltage levels within circuits. - Wikipedia; GateName_1: G$1; DeviceSetName: 1KOHM; PROD_ID: RES-07856; SymbolName_1: RESISTOR; DeviceName: -0603-1/10W-1%; LibraryName: SparkFun-Resistors
R2 R3 = 5.1KOHM5.1KOHM-0603-1/10W-1%: GateName_1: R1; SymbolName_1: RESISTOR; PROD_ID: RES-12083; DeviceName: 5.1KOHM-0603-1/10W-1%; LibraryName: SparkFun-Resistors; DeviceSetName: 5.1KOHM
R5 = 100KOHM-0603-1/10W-1%: 100kÎ© resistor    A resistor is a passive two-terminal electrical component that implements electrical resistance as a circuit element. Resistors act to reduce current flow, and, at the same time, act to lower voltage levels within circuits. - Wikipedia; GateName_1: G$1; PROD_ID: RES-07828; SymbolName_1: RESISTOR; DeviceName: -0603-1/10W-1%; LibraryName: SparkFun-Resistors; DeviceSetName: 100KOHM
R9 = 10KOHM-0603-1/10W-1%: 10kÎ© resistor    A resistor is a passive two-terminal electrical component that implements electrical resistance as a circuit element. Resistors act to reduce current flow, and, at the same time, act to lower voltage levels within circuits. - Wikipedia; GateName_1: G$1; DeviceSetName: 10KOHM; PROD_ID: RES-00824; SymbolName_1: RESISTOR; DeviceName: -0603-1/10W-1%; LibraryName: SparkFun-Resistors
R10 = 20KOHM-0603-1/10W-1%: 20kÎ© resistor    A resistor is a passive two-terminal electrical component that implements electrical resistance as a circuit element. Resistors act to reduce current flow, and, at the same time, act to lower voltage levels within circuits. - Wikipedia; GateName_1: G$1; DeviceSetName: 20KOHM; PROD_ID: RES-09383; SymbolName_1: RESISTOR; DeviceName: -0603-1/10W-1%; LibraryName: SparkFun-Resistors
S1 S2 = MOMENTARY-SWITCH-SPST-SMD-5.2-TALL-REDUNDANT: Momentary Switch (Pushbutton) - SPST    Normally-open (NO) SPST momentary switches (buttons, pushbuttons). Variants  PTH-12MM - 12mm square, through-hole  Momentary Pushbutton Switch - 12mm Square (COM-09190)     PTH-6.0MM, PTH-6.0MM-KIT - 6.0mm square, through-hole  Mini Pushbutton Switch (COM-00097)  KIT package intended for soldering kit's - only one side of pads' copper is exposed.     PTH-RIGHT-ANGLE-KIT - Right-angle, through-hole  Right Angle Tactile Button - Used on SparkFun BigTime Watch Kit     SMD-12MM - 12mm square, surface-mount  Tactile Button - SMD (12mm) (COM-12993)  Used on SparkFun PicoBoard     SMD-4.5MM - 4.5mm Square Trackball Switch  Used on SparkFun Blackberry Trackballer Breakout     SMD-4.6MMX2.8MM -  4.60mm x 2.80mm, surface mount  Used on SparkFun SAMD21 Mini Breakout     SMD-5.2MM, SMD-5.2-REDUNDANT - 5.2mm square, surface-mount  Mini Pushbutton Switch - SMD (COM-08720)  Used on Arduino Pro Mini  REDUNDANT package connects both switch circuits together     SMD-6.0X3.5MM - 6.0 x 3.5mm, surface mount  Momentary Reset Switch SMD (COM-08229)     SMD-6.2MM-TALL - 6.2mm square, surface mount  Tactile Button - SMD (6mm)  Used on SparkFun Digital Sandbox     SMD-RIGHT-ANGLE - Right-angle, surface mount  Used on SparkFun Block for IntelÂ® Edison - Arduino; GateName_1: G$1; SymbolName_1: SWITCH-MOMENTARY-2; PROD_ID: SWCH-14139; DeviceName: -SMD-5.2-TALL-REDUNDANT; LibraryName: SparkFun-Switches; DeviceSetName: MOMENTARY-SWITCH-SPST
TP1-TP3 = TEST-POINT3X5: SparkFun Test Points    Bare copper test points for troubleshooting or In-Circuit-Testing. These are used by our Production team for verifying production board runs using pogo-pins on test beds.   SparkFun Products: SparkFun LSM9DS1 Breakout  SparkFun PSOC  SparkFun Load Cell Amplifier; GateName_1: G$1; DeviceName: 3X5; SymbolName_1: TEST-POINT; LibraryName: SparkFun-Connectors; DeviceSetName: TEST-POINT
U5 = AP7361C-33FGEUDFN-8: AP7361C 3.3V LDO Regulator; GateName_1: G$1; PROD_ID: VREG-14094; SymbolName_1: AP7361C; DeviceName: UDFN-8; LibraryName: SparkFun-IC-Power; DeviceSetName: AP7361C-33FGE